# Altium schematic sheet Communication.SchDoc
size A4; SheetNumber: 11; SheetTotal: 15
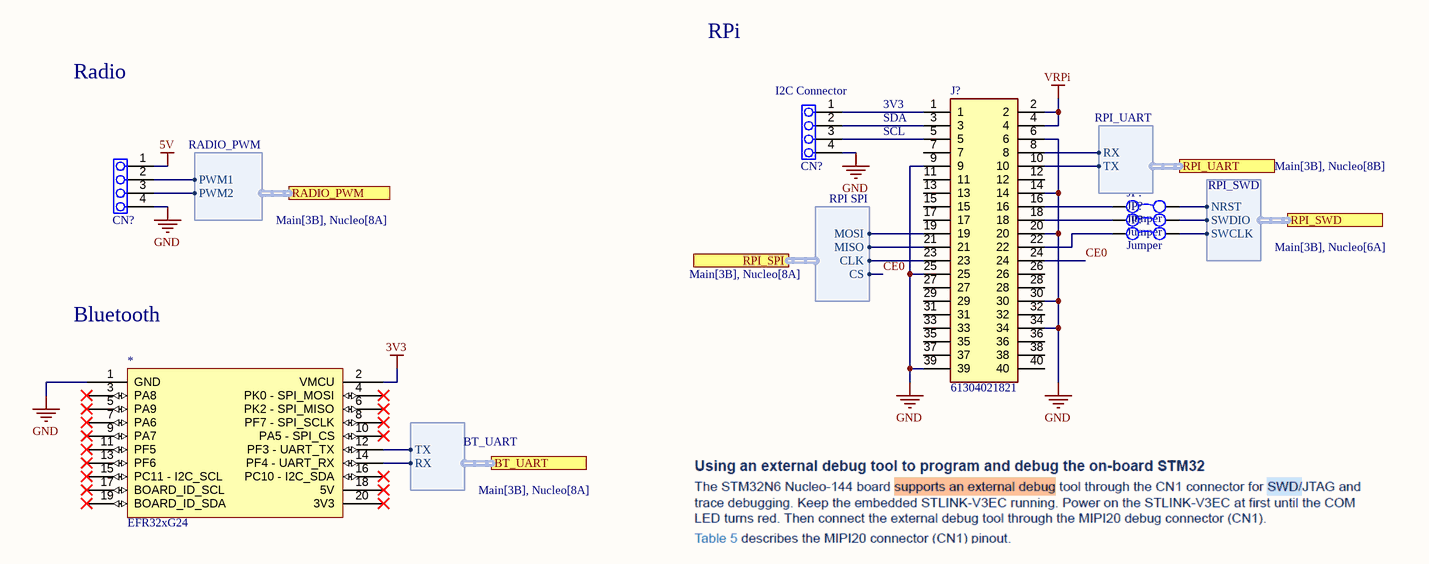
[diagram p0: Communication.SchDoc]

## Parts
(Parts that share a designator on the sheet are numbered #1, #2 ... from top to bottom, then left to right.)
*  EFR32xG24
CN?#1  Pins 1x3  [PIN-1X4]  (value not drawn)
CN?#2  Pins 1x3  [PIN-1X4]  (value not drawn)
J?  61304021821  [RHDR40W97P254X254_2X20_5130X508X860P]
JP?#1  Jumper  [PIN-1X2]
JP?#2  Jumper  [PIN-1X2]
JP?#3  Jumper  [PIN-1X2]

## Ports
BT_UART (harness BT_UART, see Main[3B], Nucleo[8A]), RADIO_PWM (harness RADIO_PWM, see Main[3B], Nucleo[8A]), RPI_SPI (harness RPi SPI, see Main[3B], Nucleo[8A]), RPI_SWD (harness RPI_SWD, see Main[3B], Nucleo[6A]), RPI_UART (harness RPI_UART, see Main[3B], Nucleo[8B])

## Harnesses
RADIO_PWM: PWM1, PWM2
RPI_UART: RX, TX
RPI SPI: CS, MOSI, MISO, CLK
RPI_SWD: NRST, SWDIO, SWCLK
BT_UART: RX, TX

## Nets
3V3: *.2(VMCU)
5V: CN?#2.1
GND: *.1(GND) CN?#1.4 CN?#2.4 J?.6 J?.9 J?.14 J?.20 J?.25 J?.30 J?.34 J?.39
VRPi: J?.2 J?.4
CE0: J?.24 ; port RPI_SPI.CS
Net*_12: *.12(PF3_-_UART_TX) ; port BT_UART.TX
Net*_14: *.14(PF4_-_UART_RX) ; port BT_UART.RX
NetCN?#1_1: CN?#1.1 J?.1
NetCN?#1_2: CN?#1.2 J?.3
NetCN?#1_3: CN?#1.3 J?.5
NetCN?#2_2: CN?#2.2 ; port RADIO_PWM.PWM1
NetCN?#2_3: CN?#2.3 ; port RADIO_PWM.PWM2
NetJ?_8: J?.8 ; port RPI_UART.RX
NetJ?_10: J?.10 ; port RPI_UART.TX
NetJ?_16: J?.16 JP?#1.1
NetJ?_18: J?.18 JP?#2.1
NetJ?_19: J?.19 ; port RPI_SPI.MOSI
NetJ?_21: J?.21 ; port RPI_SPI.MISO
NetJ?_22: J?.22 JP?#3.1
NetJ?_23: J?.23 ; port RPI_SPI.CLK
NetJP?#1_2: JP?#1.2 ; port RPI_SWD.NRST
NetJP?#2_2: JP?#2.2 ; port RPI_SWD.SWDIO
NetJP?#3_2: JP?#3.2 ; port RPI_SWD.SWCLK

Not connected (* = marked no-connect by the designer): * 3(PA8)* 4(PK0_-_SPI_MOSI)* 5(PA9)* 6(PK2_-_SPI_MISO)* 7(PA6)* 8(PF7_-_SPI_SCLK)* 9(PA7)* 10(PA5_-_SPI_CS)* 11(PF5)* 13(PF6)* 15(PC11_-_I2C_SCL)* 16(PC10_-_I2C_SDA)* 17(BOARD_ID_SCL)* 18(5V)* 19(BOARD_ID_SDA)* 20(3V3)*; J? 7 11 12 13 15 17 26 27 28 29 31 32 33 35 36 37 38 40

## Notes on the sheet
- RPi
- Radio
- (near CN?#1) I2C Connector
- 3V3
- SDA
- SCL
- Bluetooth
- Size
- Date
- A4
- Title
- Sheet number
- Author
- Revision

## Library data of the parts
CN?#1 CN?#2 = Pin-1x4: 2.54mm; Part Class: Connector; Order Code: 855-M50-3530342; CompType: M50-3530342; Distributor: Mouser; Package: SMD 1.27mm
J? = 61304021821: Connector; Manufacturer_Name: Wurth Elektronik; Datasheet Link: https://componentsearchengine.com/Datasheets/1/61304021821.pdf; Height: 8.6mm; Manufacturer_Part_Number: 61304021821; Mouser Part Number: 710-61304021821; Mouser Price/Stock: https://www.mouser.co.uk/ProductDetail/Wurth-Elektronik/61304021821?qs=bZr6mbWTK5mzEvTTGhcEyQ%3D%3D
JP?#1-JP?#3 = Jumper: Interconnection Device; Manufacturer: Harwin; Manufacturer Part Number: M7582-46; Manufacturer Series: M75; Additional Feature: ROHS COMPLIANT; Body/Shell Style: PLUG; Contact Pattern: RECTANGULAR; Contact Resistance: 20mR; Contact Style: SQ PIN-SKT; Dielectric Withstanding Voltage (AC): 500V; Insertion Force-Max: 6.672N; Insulation Resistance: 5GR; Number Of Connectors: 1; Rated Current (Signal): 1A; Number of Contacts: 2; Body Breadth: 0.094inch; Body Depth: 0.236inch; Body Length: 0.197inch; Mating Contact Pitch: 0.1inch; Reference Standard: UL; Reliability: COMMERCIAL; Supplier: Mouser; Supplier Part Number: 855-M7582-46; RoHS: Yes; Category: Uncategorized; Stock: 4991; Pricing: 1=0.19, 10=0.125, 50=0.125, 100=0.104, 1000=0.075, 10000=0.072 (USD); Contact Material: Bronze; Contact Finish - Mating: SN; Contact Finish - Termination: Tin (Sn); Insulation Color: Black; Insulation Material: Glass; Min Operating Temperature: -55°C; Max Operating Temperature: 105°C; Connector Type: Interconnection Device; JESD-609 Code: e3; Contact Gender: Female; Mounting Style: STRAIGHT; Number of Rows Loaded: 1; Reach SVHC Compliant: Yes; RoHS Compliant: Yes; ComponentLink1URL: https://datasheet.ciiva.com:443/pdfs/VipMasterIC/IC/HRWN/HRWNS06295/HRWNS06295-1.pdf?src-supplier=IHS+Markit; ComponentLink1Description: https://datasheet.ciiva.com:443/pdfs/VipMasterIC/IC/HRWN/HRWNS06295/HRWNS06295-1.pdf?src-supplier=IHS+Markit; ComponentLink2URL: http://www.mouser.com/ds/2/181/M7580-M7583-351524.pdf?src-supplier=Mouser; ComponentLink2Description: http://www.mouser.com/ds/2/181/M7580-M7583-351524.pdf?src-supplier=Mouser; ComponentLink3URL: https://cdn.harwin.com/pdfs/Harwin_PC_Connectors_M20.pdf?src-supplier=Digikey; ComponentLink3Description: https://cdn.harwin.com/pdfs/Harwin_PC_Connectors_M20.pdf?src-supplier=Digikey; ComponentLink4URL: http://www.harwin.com/include/downloads/pdfs/2010PAGE125.PDF?src-supplier=Avnet; ComponentLink4Description: http://www.harwin.com/include/downloads/pdfs/2010PAGE125.PDF?src-supplier=Avnet